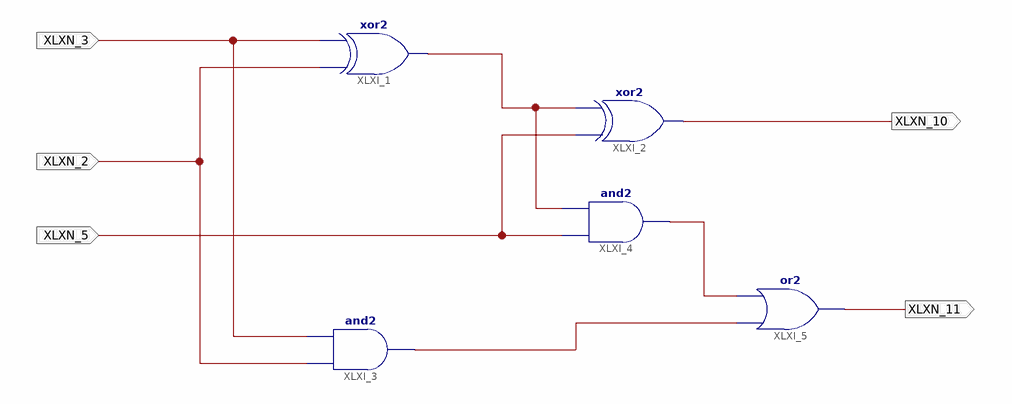
[diagram p0: schematic sheet 1]
// Xilinx ISE schematic HalfAdder.sch (spartan3e) as structural Verilog: 5 symbols, 5 ports
module HalfAdder (
  input  XLXN_2,
  input  XLXN_3,
  input  XLXN_5,
  output XLXN_10,
  output XLXN_11
);

  wire XLXN_6, XLXN_8, XLXN_9;

  xor XLXI_1 (XLXN_6, XLXN_2, XLXN_3);
  xor XLXI_2 (XLXN_10, XLXN_5, XLXN_6);
  and XLXI_3 (XLXN_8, XLXN_2, XLXN_3);
  and XLXI_4 (XLXN_9, XLXN_5, XLXN_6);
  or XLXI_5 (XLXN_11, XLXN_8, XLXN_9);
endmodule
